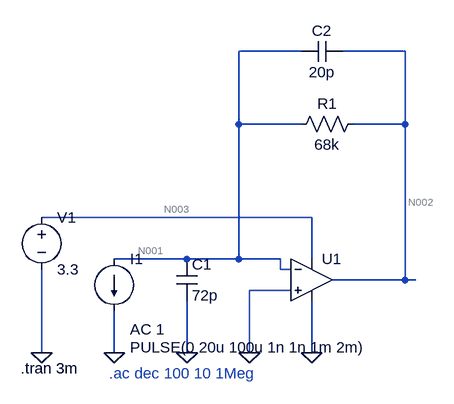
[diagram p0: schematic TIA_Simulation.asc]
TIA_Simulation.asc, the LTspice schematic file:
Version 4.1
SHEET 1 880 680
WIRE 96 -256 0 -256
WIRE 256 -256 160 -256
WIRE 0 -144 0 -256
WIRE 96 -144 0 -144
WIRE 256 -144 256 -256
WIRE 256 -144 176 -144
WIRE 112 0 -304 0
WIRE -80 64 -192 64
WIRE 0 64 0 -144
WIRE 0 64 -80 64
WIRE 64 64 0 64
WIRE 112 64 112 0
WIRE 64 80 64 64
WIRE 80 80 64 80
WIRE 256 96 256 -144
WIRE 256 96 144 96
WIRE 272 96 256 96
WIRE 80 112 16 112
WIRE -304 208 -304 80
WIRE -192 208 -192 144
WIRE -80 208 -80 128
WIRE 16 208 16 112
WIRE 112 208 112 128
FLAG 112 208 0
FLAG 16 208 0
FLAG -192 208 0
FLAG -80 208 0
FLAG -304 208 0
SYMBOL OpAmps\\UniversalOpAmp2 112 96 R0
SYMATTR InstName U1
SYMBOL current -192 64 R0
WINDOW 3 24 136 Left 2
WINDOW 123 24 108 Left 2
WINDOW 39 0 0 Left 0
SYMATTR InstName I1
SYMATTR Value PULSE(0 20u 100u 1n 1n 1m 2m)
SYMATTR Value2 AC 1
SYMBOL cap -96 64 R0
SYMATTR InstName C1
SYMATTR Value 72p
SYMBOL res 192 -160 R90
WINDOW 0 0 56 VBottom 2
WINDOW 3 32 56 VTop 2
SYMATTR InstName R1
SYMATTR Value 68k
SYMBOL voltage -304 -16 R0
WINDOW 123 0 0 Left 0
WINDOW 39 0 0 Left 0
SYMATTR InstName V1
SYMATTR Value 3.3
SYMBOL cap 160 -272 R90
WINDOW 0 0 32 VBottom 2
WINDOW 3 32 32 VTop 2
SYMATTR InstName C2
SYMATTR Value 20p
TEXT -336 232 Left 2 !.tran 3m
TEXT -200 240 Left 2 ;.ac dec 100 10 1Meg

The netlist it stands for:
* TIA_Simulation.asc
X§U1 0 N001 N003 0 N002 level2 Avol=1Meg GBW=10Meg Slew=10Meg Ilimit=25m Rail=0 Vos=0 En=0 Enk=0 In=0 Ink=0 Rin=500Meg  ; pins In+ In- V+ V- OUT
I1 N001 0 PULSE(0 20u 100u 1n 1n 1m 2m) AC 1
C1 N001 0 72p
R1 N002 N001 68k
V1 N003 0 3.3
C2 N002 N001 20p
.tran 3m
* .ac dec 100 10 1Meg
.lib UniversalOpAmp2.lib
.backanno
.end

* Results of the author's LTspice run, read from the files saved beside the schematic
* Operating Point, zero values left out:
*   V(n001) = 243.9 µV
*   V(n002) = 19.57 µV
*   V(n003) = 3.3 V
*   I(R1) = -3.3 nA
*   I(V1) = -827.5 nA
*   Ix(u1:1) = -3.3 nA
*   Ix(u1:2) = -3.3 nA
*   Ix(u1:3) = 827.5 nA
*   Ix(u1:4) = -802.8 nA
*   Ix(u1:5) = 3.3 nA
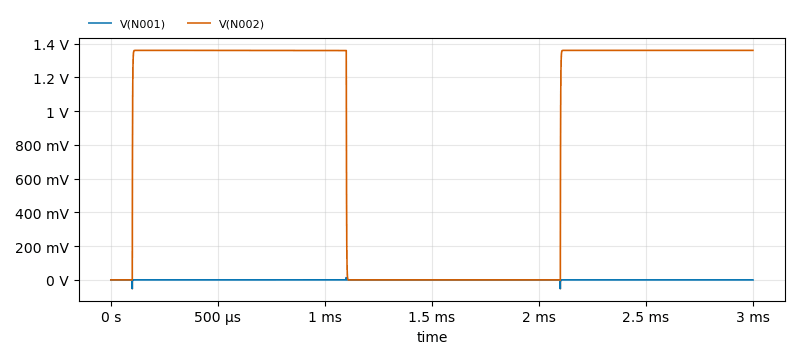
[diagram p1: Transient Analysis of TIA_Simulation.asc, plotted from the saved traces]
* Transient Analysis, 1 run:
*   V(N001): min -52.82 mV, max 14.26 mV, average 77.58 µV, rms 684.3 µV, last 300.5 nV
*   V(N002): min -208 µV, max 1.36 V, average 860.6 mV, rms 1.081 V, last 1.36 V